# EAGLE board bornhack_stoplicht_ws2812_smd_405_cap_r155 (EAGLE 6.1), part 1 of 2
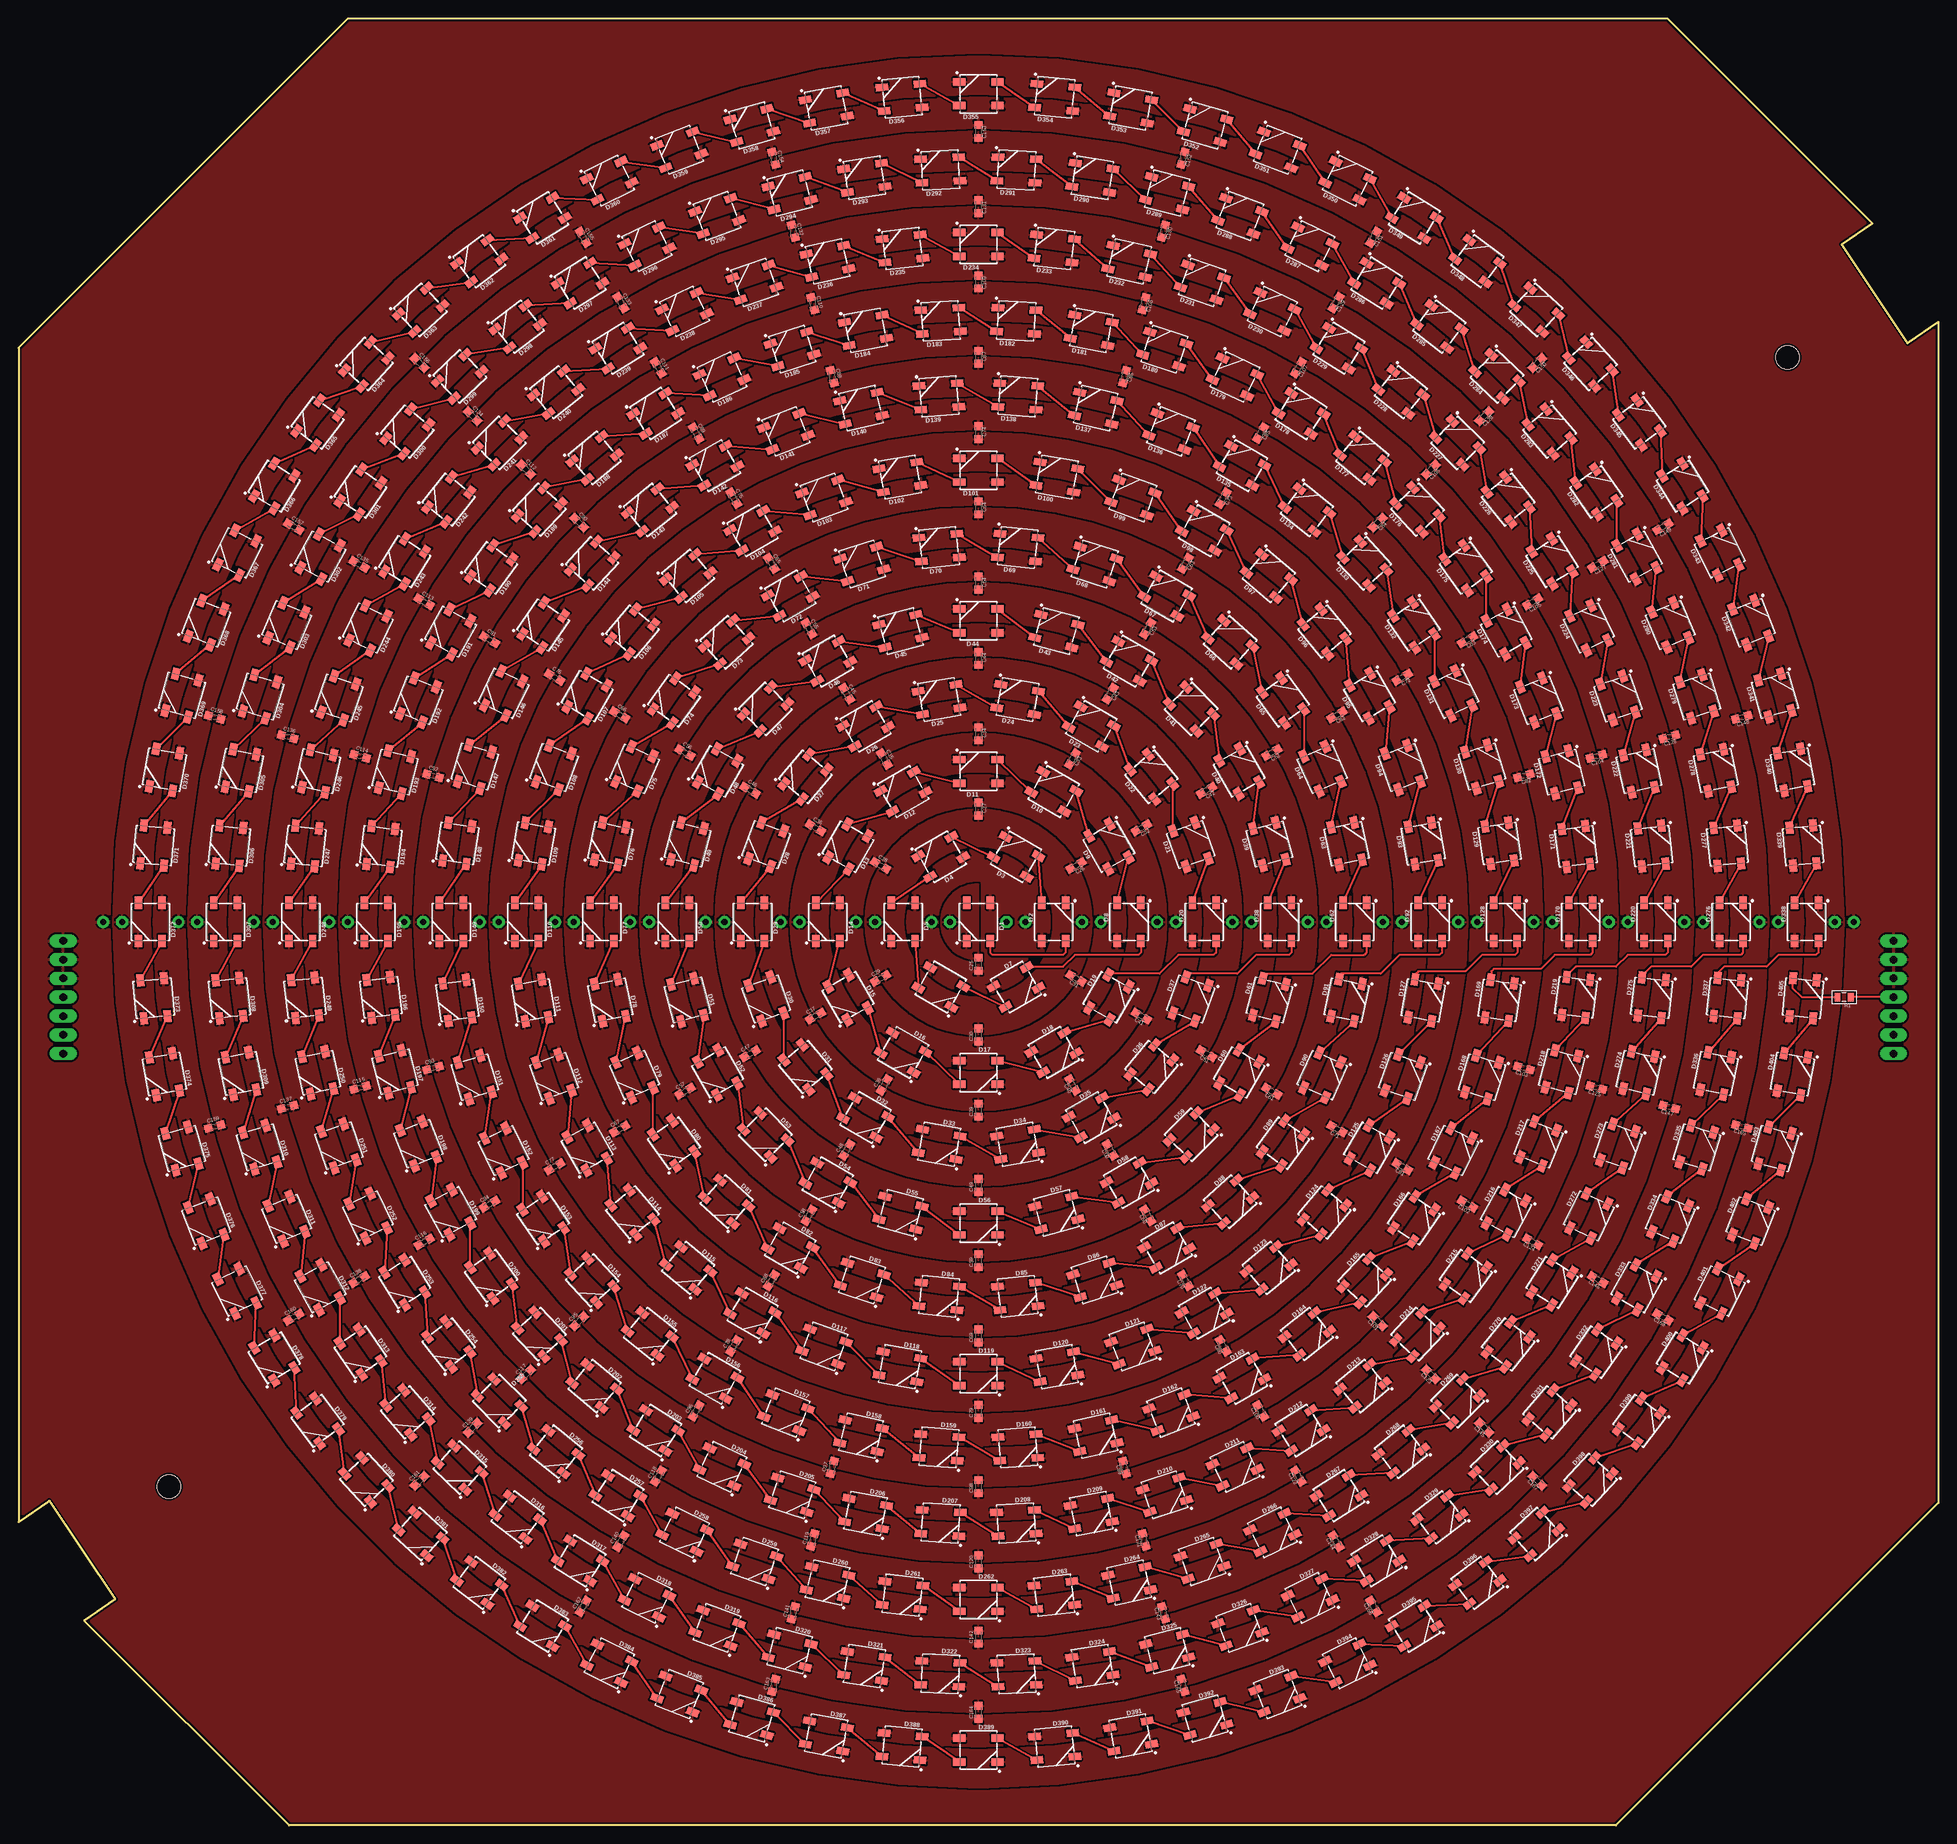
[diagram p4: board, top side]
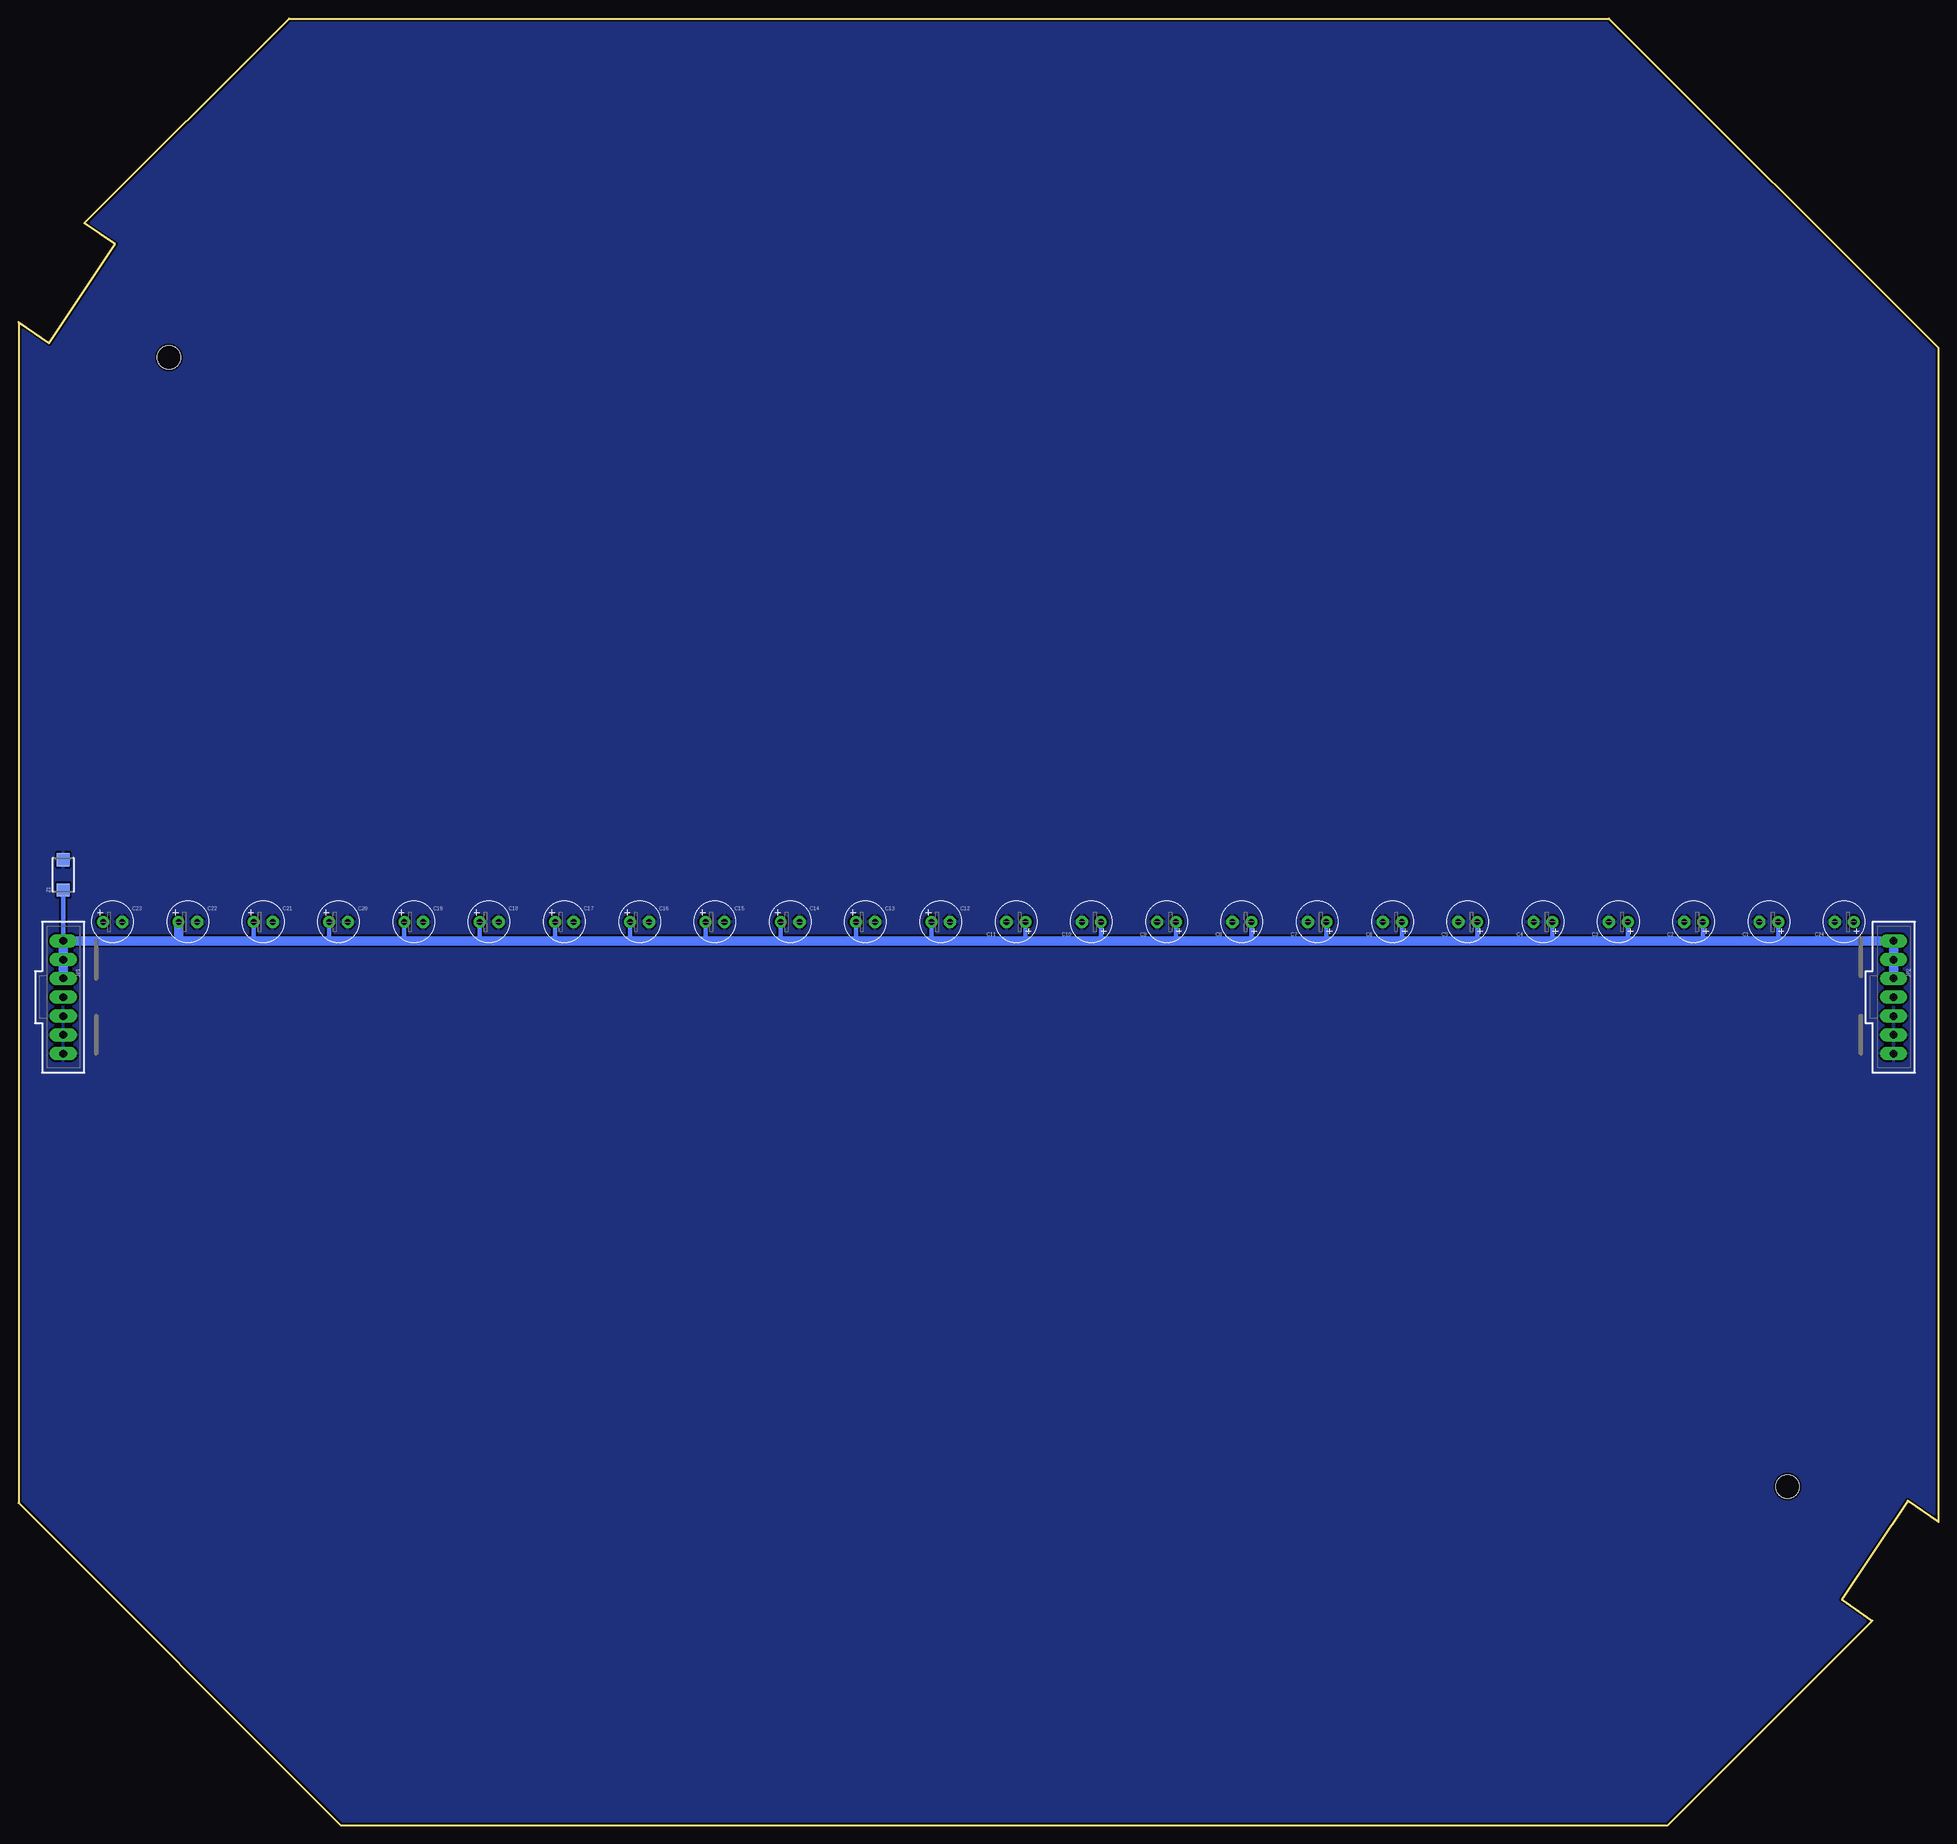
[diagram p5: board, bottom side, seen from below]

Size 259.08 x 243.84 mm. Coordinates in mm from the lower left corner, seen from the top.
Outline: 259.08,202.88 259.08,43.5 215.58,0 36.51,0 8.89,27.62 13.02,30.48 4.13,43.81 0,40.96 0,199.39 44.45,243.84 222.57,243.84 250.19,216.22 246.06,213.36 254.95,200.03 259.08,202.88
Copper layers (1*16): Top 0.035mm / dielectric 1.6mm / Bottom 0.035mm
Design rules: minimum track width 5mil, minimum drill 0.3mm, track to track 5mil, track to pad 5mil, pad to pad 5mil, via to via 5mil, smd to smd 5mil, copper to edge 0.2mm, drill to drill 6mil, minimum pad ring 10mil, minimum via ring 3mil, stop-mask expansion 4mil, vias tented up to drill 0mil, thermal gap 10mil
Holes 3.2 mm at 238.76,198.12 20.32,45.72

## Footprints (pad centres in the part's own frame; a part is rotated, then mirrored left to right if it is on the bottom)
E2,5-6 = drill 0.813 pad 1.6: + -1.27,0 | drill 0.813 pad 1.6 octagon: - 1.27,0
C0603K = smd 1.05 x 1.08: 1 -0.875,0; 2 0.875,0
WS2812-5X5-4PIN = smd 1.651 x 1: DI 2.577,1.6; DO -2.577,-1.6; GND 2.577,-1.6; VCC -2.577,1.6
70543-07 = drill 1.016 long: 1 -7.62,0; 2 -5.08,0; 3 -2.54,0; 4 0,0; 5 2.54,0; 6 5.08,0; 7 7.62,0
R0805 = smd 0.8 x 1.2: 1 -0.9,0; 2 0.9,0
FIDUCIAL_1MM = smd 1 x 1: 1 0,0
DO214AC = smd 1.8 x 1.7: 1 -2.05,0; 2 2.05,0

## Placement (x,y rotation side)
C1  [E2,5-6]  22.86,121.92 180 bottom
C2  [E2,5-6]  33.02,121.92 180 bottom
C3  [E2,5-6]  43.18,121.92 180 bottom
C4  [E2,5-6]  53.34,121.92 180 bottom
C5  [E2,5-6]  63.5,121.92 180 bottom
C6  [E2,5-6]  73.66,121.92 180 bottom
C7  [E2,5-6]  83.82,121.92 180 bottom
C8  [E2,5-6]  93.98,121.92 180 bottom
C9  [E2,5-6]  104.14,121.92 180 bottom
C10  [E2,5-6]  114.3,121.92 180 bottom
C11  [E2,5-6]  124.46,121.92 180 bottom
C12  [E2,5-6]  134.62,121.92 0 bottom
C13  [E2,5-6]  144.78,121.92 0 bottom
C14  [E2,5-6]  154.94,121.92 0 bottom
C15  [E2,5-6]  165.1,121.92 0 bottom
C16  [E2,5-6]  175.26,121.92 0 bottom
C17  [E2,5-6]  185.42,121.92 0 bottom
C18  [E2,5-6]  195.58,121.92 0 bottom
C19  [E2,5-6]  205.74,121.92 0 bottom
C20  [E2,5-6]  215.9,121.92 0 bottom
C21  [E2,5-6]  226.06,121.92 0 bottom
C22  [E2,5-6]  236.22,121.92 0 bottom
C23  [E2,5-6]  246.38,121.92 0 bottom
C24  [E2,5-6]  12.7,121.92 180 bottom
C25  100nF  [C0603K]  129.54,116.2 90 top
C26  100nF  [C0603K]  142.74,129.54 210 top
C27  100nF  [C0603K]  129.54,137.16 270 top
C28  100nF  [C0603K]  116.34,129.54 330 top
C29  100nF  [C0603K]  116.34,114.3 30 top
C30  100nF  [C0603K]  129.54,106.68 90 top
C31  100nF  [C0603K]  142.74,114.3 150 top
C32  100nF  [C0603K]  151.54,134.62 210 top
C33  100nF  [C0603K]  142.24,143.92 240 top
C34  100nF  [C0603K]  129.54,147.32 270 top
C35  100nF  [C0603K]  116.84,143.92 300 top
C36  100nF  [C0603K]  107.54,134.62 330 top
C37  100nF  [C0603K]  107.54,109.22 30 top
C38  100nF  [C0603K]  116.84,99.92 60 top
C39  100nF  [C0603K]  129.54,96.52 90 top
C40  100nF  [C0603K]  142.24,99.92 120 top
C41  100nF  [C0603K]  151.54,109.22 150 top
C42  100nF  [C0603K]  160.34,139.7 210 top
C43  100nF  [C0603K]  147.32,152.72 240 top
C44  100nF  [C0603K]  129.54,157.48 270 top
C45  100nF  [C0603K]  111.76,152.72 300 top
C46  100nF  [C0603K]  98.74,139.7 330 top
C47  100nF  [C0603K]  98.74,104.14 30 top
C48  100nF  [C0603K]  111.76,91.12 60 top
C49  100nF  [C0603K]  129.54,86.36 90 top
C50  100nF  [C0603K]  147.32,91.12 120 top
C51  100nF  [C0603K]  160.34,104.14 150 top
C52  100nF  [C0603K]  169.13,144.78 210 top
C53  100nF  [C0603K]  152.4,161.51 240 top
C54  100nF  [C0603K]  129.54,167.64 270 top
C55  100nF  [C0603K]  106.68,161.51 300 top
C56  100nF  [C0603K]  89.95,144.78 330 top
C57  100nF  [C0603K]  89.95,99.06 30 top
C58  100nF  [C0603K]  106.68,82.33 60 top
C59  100nF  [C0603K]  129.54,76.2 90 top
C60  100nF  [C0603K]  152.4,82.33 120 top
C61  100nF  [C0603K]  169.13,99.06 150 top
C62  100nF  [C0603K]  177.93,149.86 210 top
C63  100nF  [C0603K]  157.48,170.31 240 top
C64  100nF  [C0603K]  129.54,177.8 270 top
C65  100nF  [C0603K]  101.6,170.31 300 top
C66  100nF  [C0603K]  81.15,149.86 330 top
C67  100nF  [C0603K]  81.15,93.98 30 top
C68  100nF  [C0603K]  101.6,73.53 60 top
C69  100nF  [C0603K]  129.54,66.04 90 top
C70  100nF  [C0603K]  157.48,73.53 120 top
C71  100nF  [C0603K]  177.93,93.98 150 top
C72  100nF  [C0603K]  186.73,154.94 210 top
C73  100nF  [C0603K]  162.56,179.11 240 top
C74  100nF  [C0603K]  129.54,187.96 270 top
C75  100nF  [C0603K]  96.52,179.11 300 top
C76  100nF  [C0603K]  72.35,154.94 330 top
C77  100nF  [C0603K]  72.35,88.9 30 top
C78  100nF  [C0603K]  96.52,64.73 60 top
C79  100nF  [C0603K]  129.54,55.88 90 top
C80  100nF  [C0603K]  162.56,64.73 120 top
C81  100nF  [C0603K]  186.73,88.9 150 top
C82  100nF  [C0603K]  203.14,141.64 195 top
C83  100nF  [C0603K]  195.53,160.02 210 top
C84  100nF  [C0603K]  183.42,175.8 225 top
C85  100nF  [C0603K]  167.64,187.91 240 top
C86  100nF  [C0603K]  149.26,195.52 255 top
C87  100nF  [C0603K]  129.54,198.12 270 top
C88  100nF  [C0603K]  109.82,195.52 285 top
C89  100nF  [C0603K]  91.44,187.91 300 top
C90  100nF  [C0603K]  75.66,175.8 315 top
C91  100nF  [C0603K]  63.55,160.02 330 top
C92  100nF  [C0603K]  55.94,141.64 345 top
C93  100nF  [C0603K]  55.94,102.2 15 top
C94  100nF  [C0603K]  63.55,83.82 30 top
C95  100nF  [C0603K]  75.66,68.04 45 top
C96  100nF  [C0603K]  91.44,55.93 60 top
C97  100nF  [C0603K]  109.82,48.32 75 top
C98  100nF  [C0603K]  129.54,45.72 90 top
C99  100nF  [C0603K]  149.26,48.32 105 top
C100  100nF  [C0603K]  167.64,55.93 120 top
C101  100nF  [C0603K]  183.42,68.04 135 top
C102  100nF  [C0603K]  195.53,83.82 150 top
C103  100nF  [C0603K]  203.14,102.2 165 top
C104  100nF  [C0603K]  212.96,144.27 195 top
C105  100nF  [C0603K]  204.33,165.1 210 top
C106  100nF  [C0603K]  190.61,182.99 225 top
C107  100nF  [C0603K]  172.72,196.71 240 top
C108  100nF  [C0603K]  151.89,205.34 255 top
C109  100nF  [C0603K]  129.54,208.28 270 top
C110  100nF  [C0603K]  107.19,205.34 285 top
C111  100nF  [C0603K]  86.36,196.71 300 top
C112  100nF  [C0603K]  68.47,182.99 315 top
C113  100nF  [C0603K]  54.75,165.1 330 top
C114  100nF  [C0603K]  46.12,144.27 345 top
C115  100nF  [C0603K]  46.12,99.57 15 top
C116  100nF  [C0603K]  54.75,78.74 30 top
C117  100nF  [C0603K]  68.47,60.85 45 top
C118  100nF  [C0603K]  86.36,47.13 60 top
C119  100nF  [C0603K]  107.19,38.5 75 top
C120  100nF  [C0603K]  129.54,35.56 90 top
C121  100nF  [C0603K]  151.89,38.5 105 top
C122  100nF  [C0603K]  172.72,47.13 120 top
C123  100nF  [C0603K]  190.61,60.85 135 top
C124  100nF  [C0603K]  204.33,78.74 150 top
C125  100nF  [C0603K]  212.96,99.57 165 top
C126  100nF  [C0603K]  222.77,146.9 195 top
C127  100nF  [C0603K]  213.13,170.18 210 top
C128  100nF  [C0603K]  197.79,190.17 225 top
C129  100nF  [C0603K]  177.8,205.51 240 top
C130  100nF  [C0603K]  154.52,215.15 255 top
C131  100nF  [C0603K]  129.54,218.44 270 top
C132  100nF  [C0603K]  104.56,215.15 285 top
C133  100nF  [C0603K]  81.28,205.51 300 top
C134  100nF  [C0603K]  61.29,190.17 315 top
C135  100nF  [C0603K]  45.95,170.18 330 top
C136  100nF  [C0603K]  36.31,146.9 345 top
C137  100nF  [C0603K]  36.31,96.94 15 top
C138  100nF  [C0603K]  45.95,73.66 30 top
C139  100nF  [C0603K]  61.29,53.67 45 top
C140  100nF  [C0603K]  81.28,38.33 60 top
C141  100nF  [C0603K]  104.56,28.69 75 top
C142  100nF  [C0603K]  129.54,25.4 90 top
C143  100nF  [C0603K]  154.52,28.69 105 top
C144  100nF  [C0603K]  177.8,38.33 120 top
C145  100nF  [C0603K]  197.79,53.67 135 top
C146  100nF  [C0603K]  213.13,73.66 150 top
C147  100nF  [C0603K]  222.77,96.94 165 top
C148  100nF  [C0603K]  232.58,149.53 195 top
C149  100nF  [C0603K]  221.93,175.26 210 top
C150  100nF  [C0603K]  204.97,197.35 225 top
C151  100nF  [C0603K]  182.88,214.31 240 top
C152  100nF  [C0603K]  157.15,224.96 255 top
C153  100nF  [C0603K]  129.54,228.6 270 top
C154  100nF  [C0603K]  101.93,224.96 285 top
C155  100nF  [C0603K]  76.2,214.31 300 top
C156  100nF  [C0603K]  54.11,197.35 315 top
C157  100nF  [C0603K]  37.15,175.26 330 top
C158  100nF  [C0603K]  26.5,149.53 345 top
C159  100nF  [C0603K]  26.5,94.31 15 top
C160  100nF  [C0603K]  37.15,68.58 30 top
C161  100nF  [C0603K]  54.11,46.49 45 top
C162  100nF  [C0603K]  76.2,29.53 60 top
C163  100nF  [C0603K]  101.93,18.88 75 top
C164  100nF  [C0603K]  129.54,15.24 90 top
C165  100nF  [C0603K]  157.15,18.88 105 top
C166  100nF  [C0603K]  182.88,29.53 120 top
C167  100nF  [C0603K]  204.97,46.49 135 top
C168  100nF  [C0603K]  221.93,68.58 150 top
C169  100nF  [C0603K]  232.58,94.31 165 top
D1  WS2812_5050  [WS2812-5X5-4PIN]  129.54,121.92 270 top
D2  WS2812_5050  [WS2812-5X5-4PIN]  139.7,121.92 90 top
D3  WS2812_5050  [WS2812-5X5-4PIN]  134.62,130.72 150 top
D4  WS2812_5050  [WS2812-5X5-4PIN]  124.46,130.72 210 top
D5  WS2812_5050  [WS2812-5X5-4PIN]  119.38,121.92 270 top
D6  WS2812_5050  [WS2812-5X5-4PIN]  124.46,113.12 330 top
D7  WS2812_5050  [WS2812-5X5-4PIN]  134.62,113.12 30 top
D8  WS2812_5050  [WS2812-5X5-4PIN]  149.86,121.92 90 top
D9  WS2812_5050  [WS2812-5X5-4PIN]  147.14,132.08 120 top
D10  WS2812_5050  [WS2812-5X5-4PIN]  139.7,139.52 150 top
D11  WS2812_5050  [WS2812-5X5-4PIN]  129.54,142.24 180 top
D12  WS2812_5050  [WS2812-5X5-4PIN]  119.38,139.52 210 top
D13  WS2812_5050  [WS2812-5X5-4PIN]  111.94,132.08 240 top
D14  WS2812_5050  [WS2812-5X5-4PIN]  109.22,121.92 270 top
D15  WS2812_5050  [WS2812-5X5-4PIN]  111.94,111.76 300 top
D16  WS2812_5050  [WS2812-5X5-4PIN]  119.38,104.32 330 top
D17  WS2812_5050  [WS2812-5X5-4PIN]  129.54,101.6 0 top
D18  WS2812_5050  [WS2812-5X5-4PIN]  139.7,104.32 30 top
D19  WS2812_5050  [WS2812-5X5-4PIN]  147.14,111.76 60 top
D20  WS2812_5050  [WS2812-5X5-4PIN]  160.02,121.92 90 top
D21  WS2812_5050  [WS2812-5X5-4PIN]  158.18,132.34 110 top
D22  WS2812_5050  [WS2812-5X5-4PIN]  152.89,141.51 130 top
D23  WS2812_5050  [WS2812-5X5-4PIN]  144.78,148.32 150 top
D24  WS2812_5050  [WS2812-5X5-4PIN]  134.83,151.94 170 top
D25  WS2812_5050  [WS2812-5X5-4PIN]  124.25,151.94 190 top
D26  WS2812_5050  [WS2812-5X5-4PIN]  114.3,148.32 210 top
D27  WS2812_5050  [WS2812-5X5-4PIN]  106.19,141.51 230 top
D28  WS2812_5050  [WS2812-5X5-4PIN]  100.9,132.34 250 top
D29  WS2812_5050  [WS2812-5X5-4PIN]  99.06,121.92 270 top
D30  WS2812_5050  [WS2812-5X5-4PIN]  100.9,111.5 290 top
D31  WS2812_5050  [WS2812-5X5-4PIN]  106.19,102.33 310 top
D32  WS2812_5050  [WS2812-5X5-4PIN]  114.3,95.52 330 top
D33  WS2812_5050  [WS2812-5X5-4PIN]  124.25,91.9 350 top
D34  WS2812_5050  [WS2812-5X5-4PIN]  134.83,91.9 10 top
D35  WS2812_5050  [WS2812-5X5-4PIN]  144.78,95.52 30 top
D36  WS2812_5050  [WS2812-5X5-4PIN]  152.89,102.33 50 top
D37  WS2812_5050  [WS2812-5X5-4PIN]  158.18,111.5 70 top
D38  WS2812_5050  [WS2812-5X5-4PIN]  170.18,121.92 90 top
D39  WS2812_5050  [WS2812-5X5-4PIN]  168.8,132.44 105 top
D40  WS2812_5050  [WS2812-5X5-4PIN]  164.74,142.24 120 top
D41  WS2812_5050  [WS2812-5X5-4PIN]  158.28,150.66 135 top
D42  WS2812_5050  [WS2812-5X5-4PIN]  149.86,157.12 150 top
D43  WS2812_5050  [WS2812-5X5-4PIN]  140.06,161.18 165 top
D44  WS2812_5050  [WS2812-5X5-4PIN]  129.54,162.56 180 top
D45  WS2812_5050  [WS2812-5X5-4PIN]  119.02,161.18 195 top
D46  WS2812_5050  [WS2812-5X5-4PIN]  109.22,157.12 210 top
D47  WS2812_5050  [WS2812-5X5-4PIN]  100.8,150.66 225 top
D48  WS2812_5050  [WS2812-5X5-4PIN]  94.34,142.24 240 top
D49  WS2812_5050  [WS2812-5X5-4PIN]  90.28,132.44 255 top
D50  WS2812_5050  [WS2812-5X5-4PIN]  88.9,121.92 270 top
D51  WS2812_5050  [WS2812-5X5-4PIN]  90.28,111.4 285 top
D52  WS2812_5050  [WS2812-5X5-4PIN]  94.34,101.6 300 top
D53  WS2812_5050  [WS2812-5X5-4PIN]  100.8,93.18 315 top
D54  WS2812_5050  [WS2812-5X5-4PIN]  109.22,86.72 330 top
D55  WS2812_5050  [WS2812-5X5-4PIN]  119.02,82.66 345 top
D56  WS2812_5050  [WS2812-5X5-4PIN]  129.54,81.28 0 top
D57  WS2812_5050  [WS2812-5X5-4PIN]  140.06,82.66 15 top
D58  WS2812_5050  [WS2812-5X5-4PIN]  149.86,86.72 30 top
D59  WS2812_5050  [WS2812-5X5-4PIN]  158.28,93.18 45 top
D60  WS2812_5050  [WS2812-5X5-4PIN]  164.74,101.6 60 top
D61  WS2812_5050  [WS2812-5X5-4PIN]  168.8,111.4 75 top
D62  WS2812_5050  [WS2812-5X5-4PIN]  180.34,121.92 90 top
D63  WS2812_5050  [WS2812-5X5-4PIN]  179.23,132.48 102 top
D64  WS2812_5050  [WS2812-5X5-4PIN]  175.95,142.58 114 top
D65  WS2812_5050  [WS2812-5X5-4PIN]  170.64,151.78 126 top
D66  WS2812_5050  [WS2812-5X5-4PIN]  163.53,159.67 138 top
D67  WS2812_5050  [WS2812-5X5-4PIN]  154.94,165.91 150 top
D68  WS2812_5050  [WS2812-5X5-4PIN]  145.24,170.23 162 top
D69  WS2812_5050  [WS2812-5X5-4PIN]  134.85,172.44 174 top
D70  WS2812_5050  [WS2812-5X5-4PIN]  124.23,172.44 186 top
D71  WS2812_5050  [WS2812-5X5-4PIN]  113.84,170.23 198 top
D72  WS2812_5050  [WS2812-5X5-4PIN]  104.14,165.91 210 top
D73  WS2812_5050  [WS2812-5X5-4PIN]  95.55,159.67 222 top
D74  WS2812_5050  [WS2812-5X5-4PIN]  88.44,151.78 234 top
D75  WS2812_5050  [WS2812-5X5-4PIN]  83.13,142.58 246 top
D76  WS2812_5050  [WS2812-5X5-4PIN]  79.85,132.48 258 top
D77  WS2812_5050  [WS2812-5X5-4PIN]  78.74,121.92 270 top
D78  WS2812_5050  [WS2812-5X5-4PIN]  79.85,111.36 282 top
D79  WS2812_5050  [WS2812-5X5-4PIN]  83.13,101.26 294 top
D80  WS2812_5050  [WS2812-5X5-4PIN]  88.44,92.06 306 top
D81  WS2812_5050  [WS2812-5X5-4PIN]  95.55,84.17 318 top
D82  WS2812_5050  [WS2812-5X5-4PIN]  104.14,77.93 330 top
D83  WS2812_5050  [WS2812-5X5-4PIN]  113.84,73.61 342 top
D84  WS2812_5050  [WS2812-5X5-4PIN]  124.23,71.4 354 top
D85  WS2812_5050  [WS2812-5X5-4PIN]  134.85,71.4 6 top
D86  WS2812_5050  [WS2812-5X5-4PIN]  145.24,73.61 18 top
D87  WS2812_5050  [WS2812-5X5-4PIN]  154.94,77.93 30 top
D88  WS2812_5050  [WS2812-5X5-4PIN]  163.53,84.17 42 top
D89  WS2812_5050  [WS2812-5X5-4PIN]  170.64,92.06 54 top
D90  WS2812_5050  [WS2812-5X5-4PIN]  175.95,101.26 66 top
D91  WS2812_5050  [WS2812-5X5-4PIN]  179.23,111.36 78 top
D92  WS2812_5050  [WS2812-5X5-4PIN]  190.5,121.92 90 top
D93  WS2812_5050  [WS2812-5X5-4PIN]  189.57,132.51 100 top
D94  WS2812_5050  [WS2812-5X5-4PIN]  186.82,142.77 110 top
D95  WS2812_5050  [WS2812-5X5-4PIN]  182.33,152.4 120 top
D96  WS2812_5050  [WS2812-5X5-4PIN]  176.24,161.1 130 top
D97  WS2812_5050  [WS2812-5X5-4PIN]  168.72,168.62 140 top
D98  WS2812_5050  [WS2812-5X5-4PIN]  160.02,174.71 150 top
D99  WS2812_5050  [WS2812-5X5-4PIN]  150.39,179.2 160 top
D100  WS2812_5050  [WS2812-5X5-4PIN]  140.13,181.95 170 top
D101  WS2812_5050  [WS2812-5X5-4PIN]  129.54,182.88 180 top
D102  WS2812_5050  [WS2812-5X5-4PIN]  118.95,181.95 190 top
D103  WS2812_5050  [WS2812-5X5-4PIN]  108.69,179.2 200 top
D104  WS2812_5050  [WS2812-5X5-4PIN]  99.06,174.71 210 top
D105  WS2812_5050  [WS2812-5X5-4PIN]  90.36,168.62 220 top
D106  WS2812_5050  [WS2812-5X5-4PIN]  82.84,161.1 230 top
D107  WS2812_5050  [WS2812-5X5-4PIN]  76.75,152.4 240 top
D108  WS2812_5050  [WS2812-5X5-4PIN]  72.26,142.77 250 top
D109  WS2812_5050  [WS2812-5X5-4PIN]  69.51,132.51 260 top
D110  WS2812_5050  [WS2812-5X5-4PIN]  68.58,121.92 270 top
D111  WS2812_5050  [WS2812-5X5-4PIN]  69.51,111.33 280 top
D112  WS2812_5050  [WS2812-5X5-4PIN]  72.26,101.07 290 top
D113  WS2812_5050  [WS2812-5X5-4PIN]  76.75,91.44 300 top
D114  WS2812_5050  [WS2812-5X5-4PIN]  82.84,82.74 310 top
D115  WS2812_5050  [WS2812-5X5-4PIN]  90.36,75.22 320 top
D116  WS2812_5050  [WS2812-5X5-4PIN]  99.06,69.13 330 top
D117  WS2812_5050  [WS2812-5X5-4PIN]  108.69,64.64 340 top
D118  WS2812_5050  [WS2812-5X5-4PIN]  118.95,61.89 350 top
D119  WS2812_5050  [WS2812-5X5-4PIN]  129.54,60.96 0 top
D120  WS2812_5050  [WS2812-5X5-4PIN]  140.13,61.89 10 top
D121  WS2812_5050  [WS2812-5X5-4PIN]  150.39,64.64 20 top
D122  WS2812_5050  [WS2812-5X5-4PIN]  160.02,69.13 30 top
D123  WS2812_5050  [WS2812-5X5-4PIN]  168.72,75.22 40 top
D124  WS2812_5050  [WS2812-5X5-4PIN]  176.24,82.74 50 top
D125  WS2812_5050  [WS2812-5X5-4PIN]  182.33,91.44 60 top
D126  WS2812_5050  [WS2812-5X5-4PIN]  186.82,101.07 70 top
D127  WS2812_5050  [WS2812-5X5-4PIN]  189.57,111.33 80 top
D128  WS2812_5050  [WS2812-5X5-4PIN]  200.66,121.92 90 top
D129  WS2812_5050  [WS2812-5X5-4PIN]  199.87,132.52 98.6 top
D130  WS2812_5050  [WS2812-5X5-4PIN]  197.5,142.88 107.1 top
D131  WS2812_5050  [WS2812-5X5-4PIN]  193.62,152.77 115.8 top
D132  WS2812_5050  [WS2812-5X5-4PIN]  188.3,161.99 124.3 top
D133  WS2812_5050  [WS2812-5X5-4PIN]  181.67,170.3 132.9 top
D134  WS2812_5050  [WS2812-5X5-4PIN]  173.88,177.52 141.4 top
D135  WS2812_5050  [WS2812-5X5-4PIN]  165.1,183.51 150 top
D136  WS2812_5050  [WS2812-5X5-4PIN]  155.52,188.12 158.6 top
D137  WS2812_5050  [WS2812-5X5-4PIN]  145.37,191.26 167.2 top
D138  WS2812_5050  [WS2812-5X5-4PIN]  134.86,192.84 175.7 top
D139  WS2812_5050  [WS2812-5X5-4PIN]  124.22,192.84 184.3 top
D140  WS2812_5050  [WS2812-5X5-4PIN]  113.71,191.26 192.8 top
D141  WS2812_5050  [WS2812-5X5-4PIN]  103.56,188.12 201.4 top
D142  WS2812_5050  [WS2812-5X5-4PIN]  93.98,183.51 210 top
D143  WS2812_5050  [WS2812-5X5-4PIN]  85.2,177.52 218.6 top
D144  WS2812_5050  [WS2812-5X5-4PIN]  77.41,170.3 227.1 top
D145  WS2812_5050  [WS2812-5X5-4PIN]  70.78,161.99 235.7 top
D146  WS2812_5050  [WS2812-5X5-4PIN]  65.46,152.77 244.2 top
D147  WS2812_5050  [WS2812-5X5-4PIN]  61.58,142.88 252.9 top
D148  WS2812_5050  [WS2812-5X5-4PIN]  59.21,132.52 261.4 top
D149  WS2812_5050  [WS2812-5X5-4PIN]  58.42,121.92 270 top
D150  WS2812_5050  [WS2812-5X5-4PIN]  59.21,111.32 278.6 top
D151  WS2812_5050  [WS2812-5X5-4PIN]  61.58,100.96 287.1 top
D152  WS2812_5050  [WS2812-5X5-4PIN]  65.46,91.07 295.8 top
D153  WS2812_5050  [WS2812-5X5-4PIN]  70.78,81.85 304.3 top
D154  WS2812_5050  [WS2812-5X5-4PIN]  77.41,73.54 312.9 top
D155  WS2812_5050  [WS2812-5X5-4PIN]  85.2,66.32 321.4 top
D156  WS2812_5050  [WS2812-5X5-4PIN]  93.98,60.33 330 top
D157  WS2812_5050  [WS2812-5X5-4PIN]  103.56,55.72 338.6 top
D158  WS2812_5050  [WS2812-5X5-4PIN]  113.71,52.58 347.2 top
D159  WS2812_5050  [WS2812-5X5-4PIN]  124.22,51 355.7 top
D160  WS2812_5050  [WS2812-5X5-4PIN]  134.86,51 4.3 top
D161  WS2812_5050  [WS2812-5X5-4PIN]  145.37,52.58 12.8 top
D162  WS2812_5050  [WS2812-5X5-4PIN]  155.52,55.72 21.4 top
D163  WS2812_5050  [WS2812-5X5-4PIN]  165.1,60.33 30 top
D164  WS2812_5050  [WS2812-5X5-4PIN]  173.88,66.32 38.6 top
D165  WS2812_5050  [WS2812-5X5-4PIN]  181.67,73.54 47.1 top
D166  WS2812_5050  [WS2812-5X5-4PIN]  188.3,81.85 55.7 top
D167  WS2812_5050  [WS2812-5X5-4PIN]  193.62,91.07 64.2 top
D168  WS2812_5050  [WS2812-5X5-4PIN]  197.5,100.96 72.9 top
D169  WS2812_5050  [WS2812-5X5-4PIN]  199.87,111.32 81.4 top
D170  WS2812_5050  [WS2812-5X5-4PIN]  210.82,121.92 90 top
D171  WS2812_5050  [WS2812-5X5-4PIN]  210.18,132.11 97.2 top
D172  WS2812_5050  [WS2812-5X5-4PIN]  208.27,142.13 104.4 top
D173  WS2812_5050  [WS2812-5X5-4PIN]  205.11,151.84 111.6 top
D174  WS2812_5050  [WS2812-5X5-4PIN]  200.77,161.08 118.8 top
D175  WS2812_5050  [WS2812-5X5-4PIN]  195.3,169.7 126 top
D176  WS2812_5050  [WS2812-5X5-4PIN]  188.79,177.56 133.2 top
D177  WS2812_5050  [WS2812-5X5-4PIN]  181.35,184.55 140.4 top
D178  WS2812_5050  [WS2812-5X5-4PIN]  173.09,190.55 147.6 top
D179  WS2812_5050  [WS2812-5X5-4PIN]  164.15,195.46 154.8 top
D180  WS2812_5050  [WS2812-5X5-4PIN]  154.66,199.22 162 top
D181  WS2812_5050  [WS2812-5X5-4PIN]  144.77,201.76 169.2 top
D182  WS2812_5050  [WS2812-5X5-4PIN]  134.64,203.04 176.4 top
D183  WS2812_5050  [WS2812-5X5-4PIN]  124.44,203.04 183.6 top
D184  WS2812_5050  [WS2812-5X5-4PIN]  114.31,201.76 190.8 top
D185  WS2812_5050  [WS2812-5X5-4PIN]  104.42,199.22 198 top
D186  WS2812_5050  [WS2812-5X5-4PIN]  94.93,195.46 205.2 top
D187  WS2812_5050  [WS2812-5X5-4PIN]  85.99,190.55 212.4 top
D188  WS2812_5050  [WS2812-5X5-4PIN]  77.73,184.55 219.6 top
D189  WS2812_5050  [WS2812-5X5-4PIN]  70.29,177.56 226.8 top
D190  WS2812_5050  [WS2812-5X5-4PIN]  63.78,169.7 234 top
D191  WS2812_5050  [WS2812-5X5-4PIN]  58.31,161.08 241.2 top
D192  WS2812_5050  [WS2812-5X5-4PIN]  53.97,151.84 248.4 top
D193  WS2812_5050  [WS2812-5X5-4PIN]  50.81,142.13 255.6 top
D194  WS2812_5050  [WS2812-5X5-4PIN]  48.9,132.11 262.8 top
D195  WS2812_5050  [WS2812-5X5-4PIN]  48.26,121.92 270 top
D196  WS2812_5050  [WS2812-5X5-4PIN]  48.9,111.73 277.2 top
D197  WS2812_5050  [WS2812-5X5-4PIN]  50.81,101.71 284.4 top
D198  WS2812_5050  [WS2812-5X5-4PIN]  53.97,92 291.6 top
D199  WS2812_5050  [WS2812-5X5-4PIN]  58.31,82.76 298.8 top
D200  WS2812_5050  [WS2812-5X5-4PIN]  63.78,74.14 306 top
D201  WS2812_5050  [WS2812-5X5-4PIN]  70.29,66.28 313.2 top
D202  WS2812_5050  [WS2812-5X5-4PIN]  77.73,59.29 320.4 top
D203  WS2812_5050  [WS2812-5X5-4PIN]  85.99,53.29 327.6 top
D204  WS2812_5050  [WS2812-5X5-4PIN]  94.93,48.38 334.8 top
D205  WS2812_5050  [WS2812-5X5-4PIN]  104.42,44.62 342 top
D206  WS2812_5050  [WS2812-5X5-4PIN]  114.31,42.08 349.2 top
D207  WS2812_5050  [WS2812-5X5-4PIN]  124.44,40.8 356.4 top
D208  WS2812_5050  [WS2812-5X5-4PIN]  134.64,40.8 3.6 top
D209  WS2812_5050  [WS2812-5X5-4PIN]  144.77,42.08 10.8 top
D210  WS2812_5050  [WS2812-5X5-4PIN]  154.66,44.62 18 top
D211  WS2812_5050  [WS2812-5X5-4PIN]  164.15,48.38 25.2 top
D212  WS2812_5050  [WS2812-5X5-4PIN]  173.09,53.29 32.4 top
D213  WS2812_5050  [WS2812-5X5-4PIN]  181.35,59.29 39.6 top
D214  WS2812_5050  [WS2812-5X5-4PIN]  188.79,66.28 46.8 top
D215  WS2812_5050  [WS2812-5X5-4PIN]  195.3,74.14 54 top
D216  WS2812_5050  [WS2812-5X5-4PIN]  200.77,82.76 61.2 top
D217  WS2812_5050  [WS2812-5X5-4PIN]  205.11,92 68.4 top
D218  WS2812_5050  [WS2812-5X5-4PIN]  208.27,101.71 75.6 top
D219  WS2812_5050  [WS2812-5X5-4PIN]  210.18,111.73 82.8 top
D220  WS2812_5050  [WS2812-5X5-4PIN]  220.98,121.92 90 top
D221  WS2812_5050  [WS2812-5X5-4PIN]  220.4,132.16 96.4 top
D222  WS2812_5050  [WS2812-5X5-4PIN]  218.69,142.27 102.8 top
D223  WS2812_5050  [WS2812-5X5-4PIN]  215.85,152.13 109.2 top
D224  WS2812_5050  [WS2812-5X5-4PIN]  211.93,161.59 115.8 top
D225  WS2812_5050  [WS2812-5X5-4PIN]  206.97,170.57 122.2 top
D226  WS2812_5050  [WS2812-5X5-4PIN]  201.03,178.93 128.6 top
D227  WS2812_5050  [WS2812-5X5-4PIN]  194.2,186.58 135 top
D228  WS2812_5050  [WS2812-5X5-4PIN]  186.55,193.41 141.4 top
D229  WS2812_5050  [WS2812-5X5-4PIN]  178.19,199.35 147.8 top
D230  WS2812_5050  [WS2812-5X5-4PIN]  169.21,204.31 154.2 top
D231  WS2812_5050  [WS2812-5X5-4PIN]  159.75,208.23 160.8 top
D232  WS2812_5050  [WS2812-5X5-4PIN]  149.89,211.07 167.2 top
D233  WS2812_5050  [WS2812-5X5-4PIN]  139.78,212.78 173.6 top
D234  WS2812_5050  [WS2812-5X5-4PIN]  129.54,213.36 180 top
D235  WS2812_5050  [WS2812-5X5-4PIN]  119.3,212.78 186.4 top
D236  WS2812_5050  [WS2812-5X5-4PIN]  109.19,211.07 192.8 top
D237  WS2812_5050  [WS2812-5X5-4PIN]  99.33,208.23 199.2 top
D238  WS2812_5050  [WS2812-5X5-4PIN]  89.87,204.31 205.8 top
D239  WS2812_5050  [WS2812-5X5-4PIN]  80.89,199.35 212.2 top
D240  WS2812_5050  [WS2812-5X5-4PIN]  72.53,193.41 218.6 top
D241  WS2812_5050  [WS2812-5X5-4PIN]  64.88,186.58 225 top
D242  WS2812_5050  [WS2812-5X5-4PIN]  58.05,178.93 231.4 top
D243  WS2812_5050  [WS2812-5X5-4PIN]  52.11,170.57 237.8 top
D244  WS2812_5050  [WS2812-5X5-4PIN]  47.15,161.59 244.2 top
D245  WS2812_5050  [WS2812-5X5-4PIN]  43.23,152.13 250.8 top
D246  WS2812_5050  [WS2812-5X5-4PIN]  40.39,142.27 257.2 top
D247  WS2812_5050  [WS2812-5X5-4PIN]  38.68,132.16 263.6 top
D248  WS2812_5050  [WS2812-5X5-4PIN]  38.1,121.92 270 top
D249  WS2812_5050  [WS2812-5X5-4PIN]  38.68,111.68 276.4 top
D250  WS2812_5050  [WS2812-5X5-4PIN]  40.39,101.57 282.8 top
D251  WS2812_5050  [WS2812-5X5-4PIN]  43.23,91.71 289.2 top
D252  WS2812_5050  [WS2812-5X5-4PIN]  47.15,82.25 295.8 top
D253  WS2812_5050  [WS2812-5X5-4PIN]  52.11,73.27 302.2 top
D254  WS2812_5050  [WS2812-5X5-4PIN]  58.05,64.91 308.6 top
D255  WS2812_5050  [WS2812-5X5-4PIN]  64.88,57.26 315 top
D256  WS2812_5050  [WS2812-5X5-4PIN]  72.53,50.43 321.4 top
D257  WS2812_5050  [WS2812-5X5-4PIN]  80.89,44.49 327.8 top
D258  WS2812_5050  [WS2812-5X5-4PIN]  89.87,39.53 334.2 top
D259  WS2812_5050  [WS2812-5X5-4PIN]  99.33,35.61 340.8 top
D260  WS2812_5050  [WS2812-5X5-4PIN]  109.19,32.77 347.2 top
D261  WS2812_5050  [WS2812-5X5-4PIN]  119.3,31.06 353.6 top
D262  WS2812_5050  [WS2812-5X5-4PIN]  129.54,30.48 0 top
D263  WS2812_5050  [WS2812-5X5-4PIN]  139.78,31.06 6.4 top
D264  WS2812_5050  [WS2812-5X5-4PIN]  149.89,32.77 12.8 top
D265  WS2812_5050  [WS2812-5X5-4PIN]  159.75,35.61 19.2 top
D266  WS2812_5050  [WS2812-5X5-4PIN]  169.21,39.53 25.8 top
D267  WS2812_5050  [WS2812-5X5-4PIN]  178.19,44.49 32.2 top
D268  WS2812_5050  [WS2812-5X5-4PIN]  186.55,50.43 38.6 top
D269  WS2812_5050  [WS2812-5X5-4PIN]  194.2,57.26 45 top
D270  WS2812_5050  [WS2812-5X5-4PIN]  201.03,64.91 51.4 top
D271  WS2812_5050  [WS2812-5X5-4PIN]  206.97,73.27 57.8 top
D272  WS2812_5050  [WS2812-5X5-4PIN]  211.93,82.25 64.2 top
D273  WS2812_5050  [WS2812-5X5-4PIN]  215.85,91.71 70.8 top
D274  WS2812_5050  [WS2812-5X5-4PIN]  218.69,101.57 77.2 top
D275  WS2812_5050  [WS2812-5X5-4PIN]  220.4,111.68 83.6 top
D276  WS2812_5050  [WS2812-5X5-4PIN]  231.14,121.92 90 top
D277  WS2812_5050  [WS2812-5X5-4PIN]  230.62,132.2 95.8 top
D278  WS2812_5050  [WS2812-5X5-4PIN]  229.06,142.37 101.6 top
D279  WS2812_5050  [WS2812-5X5-4PIN]  226.48,152.34 107.4 top
D280  WS2812_5050  [WS2812-5X5-4PIN]  222.9,161.99 113.2 top
D281  WS2812_5050  [WS2812-5X5-4PIN]  218.38,171.22 119 top
D282  WS2812_5050  [WS2812-5X5-4PIN]  212.93,179.96 124.8 top
D283  WS2812_5050  [WS2812-5X5-4PIN]  206.62,188.11 130.7 top
D284  WS2812_5050  [WS2812-5X5-4PIN]  199.54,195.56 136.4 top
D285  WS2812_5050  [WS2812-5X5-4PIN]  191.73,202.26 142.3 top
D286  WS2812_5050  [WS2812-5X5-4PIN]  183.29,208.14 148.1 top
D287  WS2812_5050  [WS2812-5X5-4PIN]  174.29,213.14 153.9 top
D288  WS2812_5050  [WS2812-5X5-4PIN]  164.82,217.2 159.7 top
D289  WS2812_5050  [WS2812-5X5-4PIN]  155.01,220.27 165.5 top
D290  WS2812_5050  [WS2812-5X5-4PIN]  144.93,222.35 171.3 top
D291  WS2812_5050  [WS2812-5X5-4PIN]  134.68,223.39 177.1 top
D292  WS2812_5050  [WS2812-5X5-4PIN]  124.4,223.39 182.9 top
D293  WS2812_5050  [WS2812-5X5-4PIN]  114.15,222.35 188.7 top
D294  WS2812_5050  [WS2812-5X5-4PIN]  104.07,220.27 194.5 top
D295  WS2812_5050  [WS2812-5X5-4PIN]  94.26,217.2 200.3 top
D296  WS2812_5050  [WS2812-5X5-4PIN]  84.79,213.14 206.1 top
D297  WS2812_5050  [WS2812-5X5-4PIN]  75.79,208.14 211.9 top
D298  WS2812_5050  [WS2812-5X5-4PIN]  67.35,202.26 217.7 top
D299  WS2812_5050  [WS2812-5X5-4PIN]  59.54,195.56 223.6 top
D300  WS2812_5050  [WS2812-5X5-4PIN]  52.46,188.11 229.3 top
D301  WS2812_5050  [WS2812-5X5-4PIN]  46.15,179.96 235.2 top
D302  WS2812_5050  [WS2812-5X5-4PIN]  40.7,171.22 241 top
D303  WS2812_5050  [WS2812-5X5-4PIN]  36.18,161.99 246.8 top
D304  WS2812_5050  [WS2812-5X5-4PIN]  32.6,152.34 252.6 top
D305  WS2812_5050  [WS2812-5X5-4PIN]  30.02,142.37 258.4 top
D306  WS2812_5050  [WS2812-5X5-4PIN]  28.46,132.2 264.2 top
D307  WS2812_5050  [WS2812-5X5-4PIN]  27.94,121.92 270 top
D308  WS2812_5050  [WS2812-5X5-4PIN]  28.46,111.64 275.8 top
D309  WS2812_5050  [WS2812-5X5-4PIN]  30.02,101.47 281.6 top
D310  WS2812_5050  [WS2812-5X5-4PIN]  32.6,91.5 287.4 top
D311  WS2812_5050  [WS2812-5X5-4PIN]  36.18,81.85 293.2 top
D312  WS2812_5050  [WS2812-5X5-4PIN]  40.7,72.62 299 top
D313  WS2812_5050  [WS2812-5X5-4PIN]  46.15,63.88 304.8 top
D314  WS2812_5050  [WS2812-5X5-4PIN]  52.46,55.73 310.7 top
D315  WS2812_5050  [WS2812-5X5-4PIN]  59.54,48.28 316.4 top
D316  WS2812_5050  [WS2812-5X5-4PIN]  67.35,41.58 322.3 top
D317  WS2812_5050  [WS2812-5X5-4PIN]  75.79,35.7 328.1 top
D318  WS2812_5050  [WS2812-5X5-4PIN]  84.79,30.7 333.9 top
D319  WS2812_5050  [WS2812-5X5-4PIN]  94.26,26.64 339.7 top
D320  WS2812_5050  [WS2812-5X5-4PIN]  104.07,23.57 345.5 top
D321  WS2812_5050  [WS2812-5X5-4PIN]  114.15,21.49 351.3 top
D322  WS2812_5050  [WS2812-5X5-4PIN]  124.4,20.45 357.1 top
D323  WS2812_5050  [WS2812-5X5-4PIN]  134.68,20.45 2.9 top
D324  WS2812_5050  [WS2812-5X5-4PIN]  144.93,21.49 8.7 top
D325  WS2812_5050  [WS2812-5X5-4PIN]  155.01,23.57 14.5 top
D326  WS2812_5050  [WS2812-5X5-4PIN]  164.82,26.64 20.3 top
D327  WS2812_5050  [WS2812-5X5-4PIN]  174.29,30.7 26.1 top
D328  WS2812_5050  [WS2812-5X5-4PIN]  183.29,35.7 31.9 top
D329  WS2812_5050  [WS2812-5X5-4PIN]  191.73,41.58 37.7 top
D330  WS2812_5050  [WS2812-5X5-4PIN]  199.54,48.28 43.6 top
D331  WS2812_5050  [WS2812-5X5-4PIN]  206.62,55.73 49.3 top
D332  WS2812_5050  [WS2812-5X5-4PIN]  212.93,63.88 55.2 top
D333  WS2812_5050  [WS2812-5X5-4PIN]  218.38,72.62 61 top
D334  WS2812_5050  [WS2812-5X5-4PIN]  222.9,81.85 66.8 top
D335  WS2812_5050  [WS2812-5X5-4PIN]  226.48,91.5 72.6 top
D336  WS2812_5050  [WS2812-5X5-4PIN]  229.06,101.47 78.4 top
D337  WS2812_5050  [WS2812-5X5-4PIN]  230.62,111.64 84.2 top
D338  WS2812_5050  [WS2812-5X5-4PIN]  241.3,121.92 90 top
D339  WS2812_5050  [WS2812-5X5-4PIN]  240.82,132.22 95.3 top
D340  WS2812_5050  [WS2812-5X5-4PIN]  239.4,142.46 100.5 top
D341  WS2812_5050  [WS2812-5X5-4PIN]  237.03,152.5 105.9 top
D342  WS2812_5050  [WS2812-5X5-4PIN]  233.75,162.3 111.2 top
D343  WS2812_5050  [WS2812-5X5-4PIN]  229.58,171.73 116.5 top
D344  WS2812_5050  [WS2812-5X5-4PIN]  224.57,180.75 121.7 top
D345  WS2812_5050  [WS2812-5X5-4PIN]  218.73,189.27 127.1 top
D346  WS2812_5050  [WS2812-5X5-4PIN]  212.14,197.21 132.4 top
D347  WS2812_5050  [WS2812-5X5-4PIN]  204.83,204.52 137.6 top
D348  WS2812_5050  [WS2812-5X5-4PIN]  196.89,211.11 142.9 top
D349  WS2812_5050  [WS2812-5X5-4PIN]  188.37,216.95 148.3 top
D350  WS2812_5050  [WS2812-5X5-4PIN]  179.35,221.96 153.5 top
D351  WS2812_5050  [WS2812-5X5-4PIN]  169.92,226.13 158.8 top
D352  WS2812_5050  [WS2812-5X5-4PIN]  160.12,229.41 164.1 top
D353  WS2812_5050  [WS2812-5X5-4PIN]  150.08,231.78 169.5 top
D354  WS2812_5050  [WS2812-5X5-4PIN]  139.84,233.2 174.7 top
D355  WS2812_5050  [WS2812-5X5-4PIN]  129.54,233.68 180 top
D356  WS2812_5050  [WS2812-5X5-4PIN]  119.24,233.2 185.3 top
D357  WS2812_5050  [WS2812-5X5-4PIN]  109,231.78 190.5 top
D358  WS2812_5050  [WS2812-5X5-4PIN]  98.96,229.41 195.9 top
D359  WS2812_5050  [WS2812-5X5-4PIN]  89.16,226.13 201.2 top
D360  WS2812_5050  [WS2812-5X5-4PIN]  79.73,221.96 206.5 top
D361  WS2812_5050  [WS2812-5X5-4PIN]  70.71,216.95 211.7 top
D362  WS2812_5050  [WS2812-5X5-4PIN]  62.19,211.11 217.1 top
D363  WS2812_5050  [WS2812-5X5-4PIN]  54.25,204.52 222.4 top
D364  WS2812_5050  [WS2812-5X5-4PIN]  46.94,197.21 227.6 top
D365  WS2812_5050  [WS2812-5X5-4PIN]  40.35,189.27 232.9 top
D366  WS2812_5050  [WS2812-5X5-4PIN]  34.51,180.75 238.3 top
D367  WS2812_5050  [WS2812-5X5-4PIN]  29.5,171.73 243.5 top
D368  WS2812_5050  [WS2812-5X5-4PIN]  25.33,162.3 248.8 top
D369  WS2812_5050  [WS2812-5X5-4PIN]  22.05,152.5 254.1 top
D370  WS2812_5050  [WS2812-5X5-4PIN]  19.68,142.46 259.5 top
D371  WS2812_5050  [WS2812-5X5-4PIN]  18.26,132.22 264.7 top
D372  WS2812_5050  [WS2812-5X5-4PIN]  17.78,121.92 270 top
D373  WS2812_5050  [WS2812-5X5-4PIN]  18.26,111.62 275.3 top
D374  WS2812_5050  [WS2812-5X5-4PIN]  19.68,101.38 280.5 top
D375  WS2812_5050  [WS2812-5X5-4PIN]  22.05,91.34 285.9 top
D376  WS2812_5050  [WS2812-5X5-4PIN]  25.33,81.54 291.2 top
D377  WS2812_5050  [WS2812-5X5-4PIN]  29.5,72.11 296.5 top
D378  WS2812_5050  [WS2812-5X5-4PIN]  34.51,63.09 301.7 top
D379  WS2812_5050  [WS2812-5X5-4PIN]  40.35,54.57 307.1 top
D380  WS2812_5050  [WS2812-5X5-4PIN]  46.94,46.63 312.4 top
D381  WS2812_5050  [WS2812-5X5-4PIN]  54.25,39.32 317.6 top
D382  WS2812_5050  [WS2812-5X5-4PIN]  62.19,32.73 322.9 top
D383  WS2812_5050  [WS2812-5X5-4PIN]  70.71,26.89 328.3 top
D384  WS2812_5050  [WS2812-5X5-4PIN]  79.73,21.88 333.5 top
D385  WS2812_5050  [WS2812-5X5-4PIN]  89.16,17.71 338.8 top
D386  WS2812_5050  [WS2812-5X5-4PIN]  98.96,14.43 344.1 top
D387  WS2812_5050  [WS2812-5X5-4PIN]  109,12.06 349.5 top
D388  WS2812_5050  [WS2812-5X5-4PIN]  119.24,10.64 354.7 top
D389  WS2812_5050  [WS2812-5X5-4PIN]  129.54,10.16 0 top
D390  WS2812_5050  [WS2812-5X5-4PIN]  139.84,10.64 5.3 top
D391  WS2812_5050  [WS2812-5X5-4PIN]  150.08,12.06 10.5 top
D392  WS2812_5050  [WS2812-5X5-4PIN]  160.12,14.43 15.9 top
D393  WS2812_5050  [WS2812-5X5-4PIN]  169.92,17.71 21.2 top
D394  WS2812_5050  [WS2812-5X5-4PIN]  179.35,21.88 26.5 top
D395  WS2812_5050  [WS2812-5X5-4PIN]  188.37,26.89 31.7 top
D396  WS2812_5050  [WS2812-5X5-4PIN]  196.89,32.73 37.1 top
D397  WS2812_5050  [WS2812-5X5-4PIN]  204.83,39.32 42.4 top
D398  WS2812_5050  [WS2812-5X5-4PIN]  212.14,46.63 47.6 top
D399  WS2812_5050  [WS2812-5X5-4PIN]  218.73,54.57 52.9 top
D400  WS2812_5050  [WS2812-5X5-4PIN]  224.57,63.09 58.3 top
D401  WS2812_5050  [WS2812-5X5-4PIN]  229.58,72.11 63.5 top
D402  WS2812_5050  [WS2812-5X5-4PIN]  233.75,81.54 68.8 top
D403  WS2812_5050  [WS2812-5X5-4PIN]  237.03,91.34 74.1 top
D404  WS2812_5050  [WS2812-5X5-4PIN]  239.4,101.38 79.5 top
D405  WS2812_5050  [WS2812-5X5-4PIN]  240.82,111.62 84.7 top
JP1  70543-07  [70543-07]  253.05,111.76 270 bottom
JP2  70543-07  [70543-07]  6.03,111.76 270 bottom
R1  390R  [R0805]  246.38,111.76 180 top
U2  FIDUCIAL  [FIDUCIAL_1MM]  20.32,45.72 0 top
U4  FIDUCIAL  [FIDUCIAL_1MM]  238.76,198.12 0 top
Z1  SMAJ6.0CA  [DO214AC]  253.05,128.27 90 bottom